# Altium schematic sheet main.SchDoc
size A4; Author: Arkadiusz Rozmarynowicz; DrawnBy: Arkadiusz Rozmarynowicz; DocumentNumber: 1; SheetNumber: 1; SheetTotal: 7
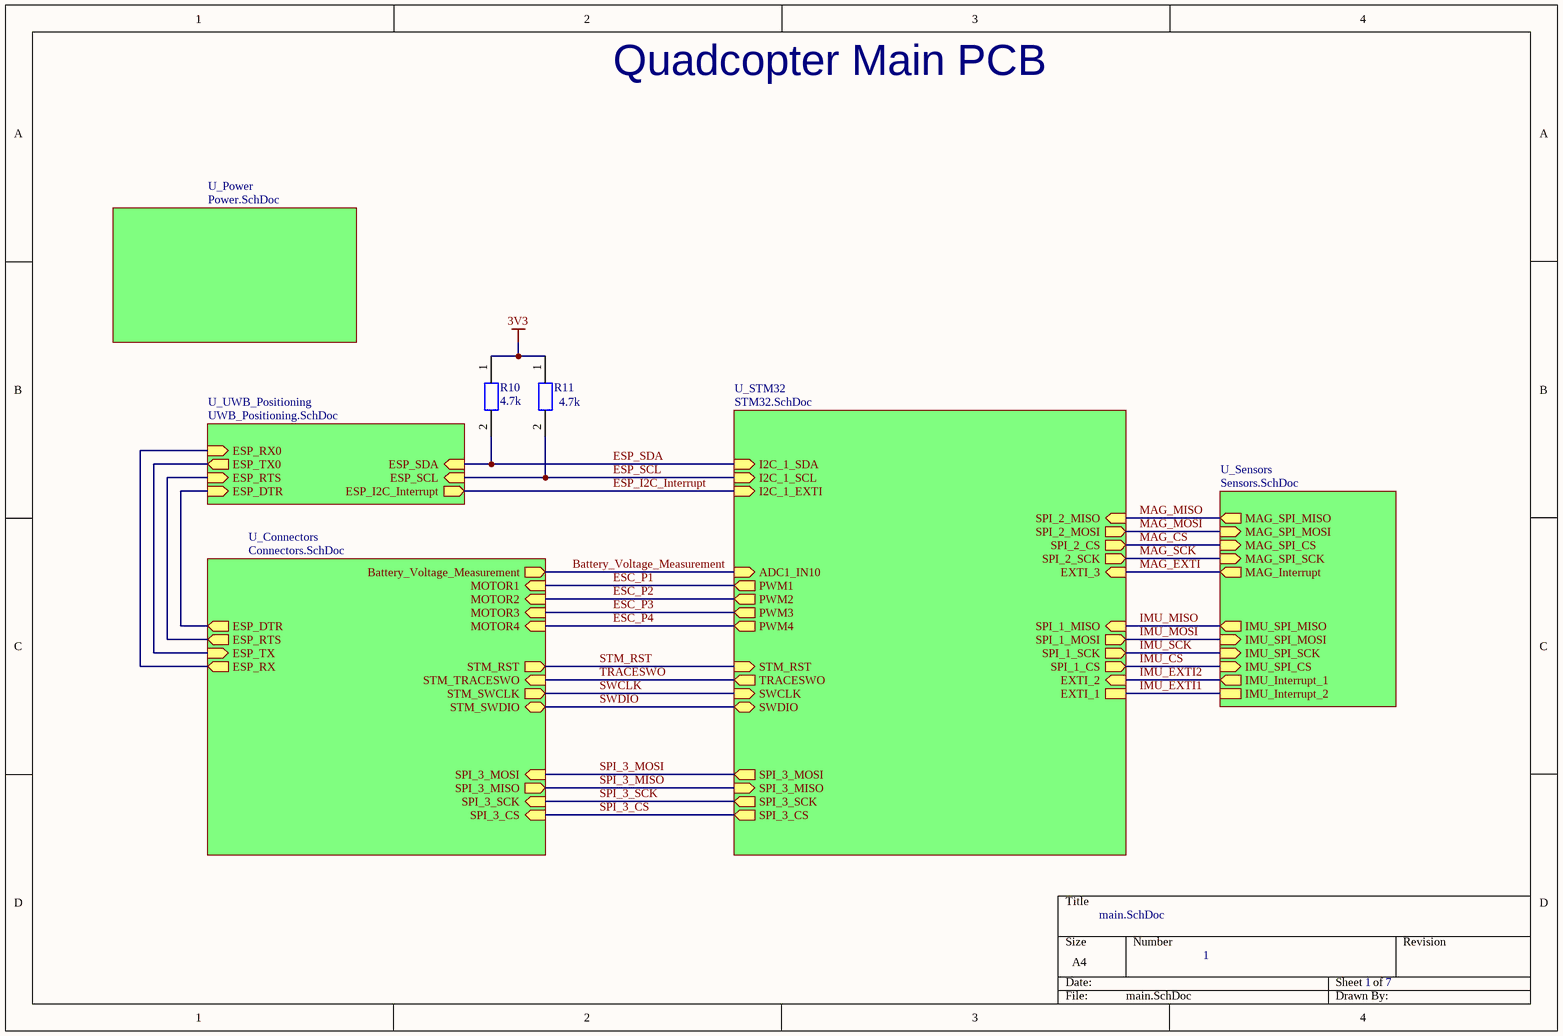
[diagram p0: main.SchDoc]

## Parts
R10  4.7k  [Res_0603_Medium_Density]
R11  4.7k  [Res_0603_Medium_Density]

## Sub-sheets
U_Connectors = Connectors.SchDoc: ESP_RTS (out), ESP_DTR (out), ESP_RX (out), STM_SWCLK (out), STM_RST (out), ESP_TX (in), STM_SWDIO (bidir), MOTOR1 (in), MOTOR2 (in), MOTOR3 (in), MOTOR4 (in), STM_TRACESWO (in), Battery_Voltage_Measurement (out), SPI_3_CS (in), SPI_3_SCK (in), SPI_3_MISO (out), SPI_3_MOSI (in)
U_Power = Power.SchDoc: no entries
U_Sensors = Sensors.SchDoc: MAG_SPI_MISO (out), MAG_SPI_MOSI (in), MAG_SPI_CS (in), MAG_SPI_SCK (in), MAG_Interrupt (out), IMU_SPI_MISO (out), IMU_SPI_MOSI (in), IMU_SPI_SCK (in), IMU_SPI_CS (in), IMU_Interrupt_1 (out), IMU_Interrupt_2
U_STM32 = STM32.SchDoc: SPI_1_CS (out), SPI_1_SCK (out), SPI_1_MISO (in), SPI_1_MOSI (out), PWM1 (out), PWM2 (out), PWM3 (out), PWM4 (out), SWDIO (bidir), SWCLK (in), SPI_3_CS (out), SPI_2_MISO (in), SPI_2_MOSI (out), SPI_3_SCK (out), SPI_3_MISO (in), SPI_3_MOSI (out), SPI_2_CS (out), SPI_2_SCK (out), TRACESWO (out), ADC1_IN10 (in), EXTI_2 (in), EXTI_3 (in), I2C_1_SCL (in), I2C_1_SDA (in), STM_RST (in), EXTI_1, I2C_1_EXTI (in)
U_UWB_Positioning = UWB_Positioning.SchDoc: ESP_DTR (in), ESP_RX0 (in), ESP_TX0 (out), ESP_RTS (in), ESP_I2C_Interrupt (out), ESP_SDA (in), ESP_SCL (in)

## Nets
3V3: R10.1 R11.1
Battery_Voltage_Measurement: sheet U_Connectors/Battery_Voltage_Measurement, sheet U_STM32/ADC1_IN10
ESC_P1: sheet U_Connectors/MOTOR1, sheet U_STM32/PWM1
ESC_P2: sheet U_Connectors/MOTOR2, sheet U_STM32/PWM2
ESC_P3: sheet U_Connectors/MOTOR3, sheet U_STM32/PWM3
ESC_P4: sheet U_Connectors/MOTOR4, sheet U_STM32/PWM4
ESP_I2C_Interrupt: sheet U_UWB_Positioning/ESP_I2C_Interrupt, sheet U_STM32/I2C_1_EXTI
ESP_SCL: R11.2 ; sheet U_UWB_Positioning/ESP_SCL, sheet U_STM32/I2C_1_SCL
ESP_SDA: R10.2 ; sheet U_UWB_Positioning/ESP_SDA, sheet U_STM32/I2C_1_SDA
IMU_CS: sheet U_Sensors/IMU_SPI_CS, sheet U_STM32/SPI_1_CS
IMU_EXTI1: sheet U_Sensors/IMU_Interrupt_2, sheet U_STM32/EXTI_1
IMU_EXTI2: sheet U_Sensors/IMU_Interrupt_1, sheet U_STM32/EXTI_2
IMU_MISO: sheet U_Sensors/IMU_SPI_MISO, sheet U_STM32/SPI_1_MISO
IMU_MOSI: sheet U_Sensors/IMU_SPI_MOSI, sheet U_STM32/SPI_1_MOSI
IMU_SCK: sheet U_Sensors/IMU_SPI_SCK, sheet U_STM32/SPI_1_SCK
MAG_CS: sheet U_Sensors/MAG_SPI_CS, sheet U_STM32/SPI_2_CS
MAG_EXTI: sheet U_Sensors/MAG_Interrupt, sheet U_STM32/EXTI_3
MAG_MISO: sheet U_Sensors/MAG_SPI_MISO, sheet U_STM32/SPI_2_MISO
MAG_MOSI: sheet U_Sensors/MAG_SPI_MOSI, sheet U_STM32/SPI_2_MOSI
MAG_SCK: sheet U_Sensors/MAG_SPI_SCK, sheet U_STM32/SPI_2_SCK
SPI_3_CS: sheet U_Connectors/SPI_3_CS, sheet U_STM32/SPI_3_CS
SPI_3_MISO: sheet U_Connectors/SPI_3_MISO, sheet U_STM32/SPI_3_MISO
SPI_3_MOSI: sheet U_Connectors/SPI_3_MOSI, sheet U_STM32/SPI_3_MOSI
SPI_3_SCK: sheet U_Connectors/SPI_3_SCK, sheet U_STM32/SPI_3_SCK
STM_RST: sheet U_Connectors/STM_RST, sheet U_STM32/STM_RST
SWCLK: sheet U_Connectors/STM_SWCLK, sheet U_STM32/SWCLK
SWDIO: sheet U_Connectors/STM_SWDIO, sheet U_STM32/SWDIO
TRACESWO: sheet U_Connectors/STM_TRACESWO, sheet U_STM32/TRACESWO
(unnamed): sheet U_Connectors/ESP_RTS, sheet U_UWB_Positioning/ESP_RTS
(unnamed): sheet U_Connectors/ESP_DTR, sheet U_UWB_Positioning/ESP_DTR
(unnamed): sheet U_Connectors/ESP_RX, sheet U_UWB_Positioning/ESP_RX0
(unnamed): sheet U_Connectors/ESP_TX, sheet U_UWB_Positioning/ESP_TX0

## Notes on the sheet
- Quadcopter Main PCB

## Library data of the parts
R10 R11 = Resistor_SMD: Part Number: AC0603JR-104K7L; Value: 4.7k; Manufacturer: *; Supplier: Mouser; Voltage: *; ComponentLink1Description: Online Store Link; ComponentLink1URL: *; Package: 0603